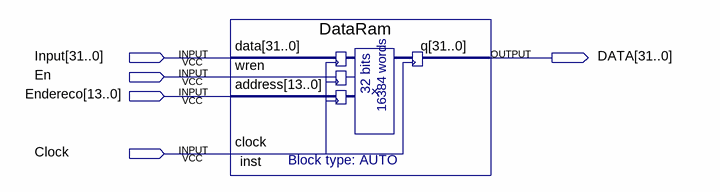
[diagram p0: schematic sheet]
// Quartus schematic DataRamtest.bdf as structural Verilog: 1 symbols, 5 pins
module DataRamtest (
  input  [31:0] Input,
  input  En,
  input  [13:0] Endereco,
  input  Clock,
  output [31:0] DATA
);

  DataRam inst (.data(Input), .wren(En), .address(Endereco), .clock(Clock), .q(DATA));
endmodule
